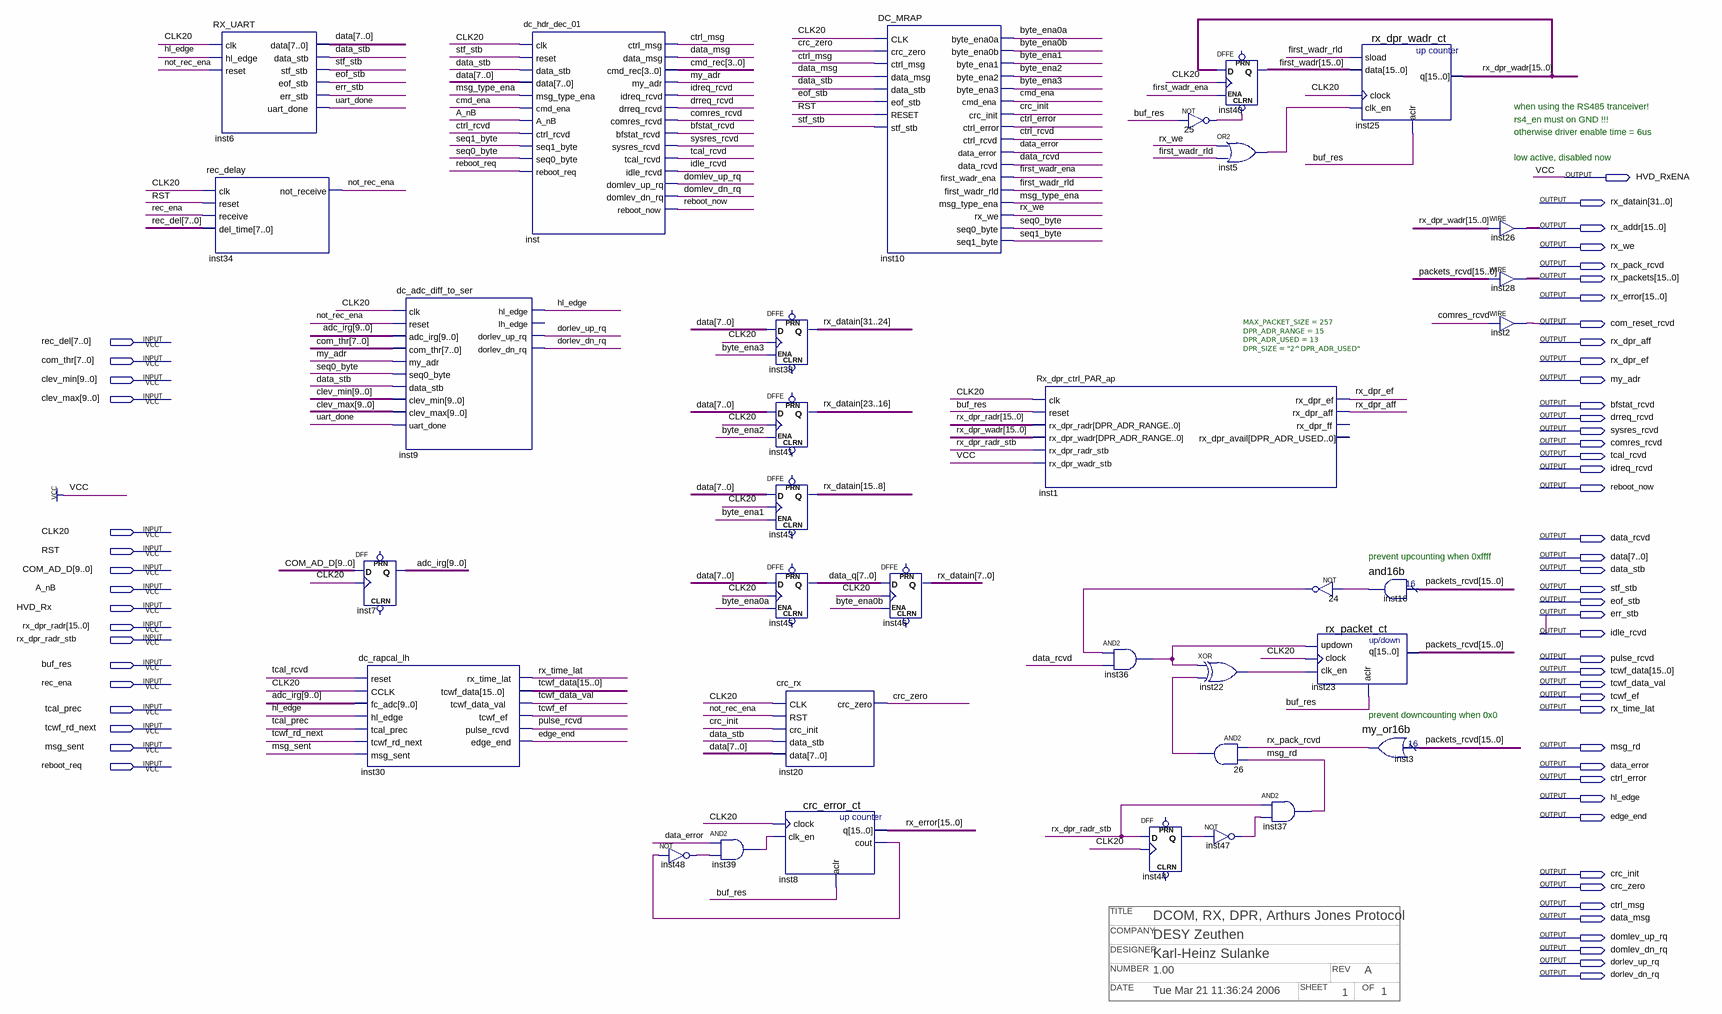
[diagram p0: schematic sheet]
// Quartus schematic DC_Rx_chan_01.bdf as structural Verilog: 34 symbols, 60 pins
// Title block: TITLE: DCOM, RX, DPR, Arthurs Jones Protocol; COMPANY: DESY Zeuthen; DESIGNER: Karl-Heinz Sulanke; NUMBER: 1.00; REV: A; DATE: Tue Mar 21 11:36:24 2006; SHEET: 1; OF: 1
module DC_Rx_chan_01 (
  input  [7:0] rec_del,
  input  [7:0] com_thr,
  input  [9:0] clev_min,
  input  [9:0] clev_max,
  input  CLK20,
  input  RST,
  input  [9:0] COM_AD_D,
  input  A_nB,
  input  HVD_Rx,
  input  [15:0] rx_dpr_radr,
  input  rx_dpr_radr_stb,
  input  buf_res,
  input  rec_ena,
  input  tcal_prec,
  input  tcwf_rd_next,
  input  msg_sent,
  input  reboot_req,
  output HVD_RxENA,
  output [31:0] rx_datain,
  output [15:0] rx_addr,
  output rx_we,
  output rx_pack_rcvd,
  output [15:0] rx_packets,
  output [15:0] rx_error,
  output com_reset_rcvd,
  output rx_dpr_aff,
  output rx_dpr_ef,
  output my_adr,
  output bfstat_rcvd,
  output drreq_rcvd,
  output sysres_rcvd,
  output comres_rcvd,
  output tcal_rcvd,
  output idreq_rcvd,
  output reboot_now,
  output data_rcvd,
  output [7:0] data,
  output data_stb,
  output stf_stb,
  output eof_stb,
  output err_stb,
  output idle_rcvd,
  output pulse_rcvd,
  output [15:0] tcwf_data,
  output tcwf_data_val,
  output tcwf_ef,
  output rx_time_lat,
  output msg_rd,
  output data_error,
  output ctrl_error,
  output hl_edge,
  output edge_end,
  output crc_init,
  output crc_zero,
  output ctrl_msg,
  output data_msg,
  output domlev_up_rq,
  output domlev_dn_rq,
  output dorlev_up_rq,
  output dorlev_dn_rq
);

  wire byte_ena0a, byte_ena0b, byte_ena1, byte_ena2, byte_ena3, cmd_ena, ctrl_rcvd, first_wadr_ena,
       first_wadr_rld, inst5_out, inst8_cout, inst16_result, inst22_out, inst36_out, inst39_out, inst44_q,
       inst47_out, inst48_out, msg_type_ena, n24_out, n25_out, n26_out, not_rec_ena, seq0_byte, seq1_byte,
       uart_done;
  wire [3:0] cmd_rec;
  wire [7:0] data_q;
  wire [9:0] adc_irg;
  wire [15:0] first_wadr, packets_rcvd, rx_dpr_wadr;

  RX_UART inst6 (
    .clk(CLK20), .hl_edge(hl_edge), .reset(not_rec_ena), .data(data), .data_stb(data_stb), .stf_stb(stf_stb),
    .eof_stb(eof_stb), .err_stb(err_stb), .uart_done(uart_done));
  rec_delay inst34 (.clk(CLK20), .reset(RST), .receive(rec_ena), .del_time(rec_del), .not_receive(not_rec_ena));
  DFF inst7[9:0] (.CLK(CLK20), .D(COM_AD_D), .Q(adc_irg));  // open: CLRN, PRN
  dc_rapcal_lh inst30 (
    .reset(tcal_rcvd), .CCLK(CLK20), .fc_adc(adc_irg), .hl_edge(hl_edge), .tcal_prec(tcal_prec),
    .tcwf_rd_next(tcwf_rd_next), .msg_sent(msg_sent), .rx_time_lat(rx_time_lat), .tcwf_data(tcwf_data),
    .tcwf_data_val(tcwf_data_val), .tcwf_ef(tcwf_ef), .pulse_rcvd(pulse_rcvd), .edge_end(edge_end));
  dc_adc_diff_to_ser inst9 (
    .clk(CLK20), .reset(not_rec_ena), .adc_irg(adc_irg), .com_thr(com_thr), .my_adr(my_adr),
    .seq0_byte(seq0_byte), .data_stb(data_stb), .clev_min(clev_min), .clev_max(clev_max),
    .uart_done(uart_done), .hl_edge(hl_edge), .dorlev_up_rq(dorlev_up_rq), .dorlev_dn_rq(dorlev_dn_rq));  // open: lh_edge
  dc_hdr_dec_01 inst (
    .clk(CLK20), .reset(stf_stb), .data_stb(data_stb), .data(data), .msg_type_ena(msg_type_ena),
    .cmd_ena(cmd_ena), .A_nB(A_nB), .ctrl_rcvd(ctrl_rcvd), .seq1_byte(seq1_byte), .seq0_byte(seq0_byte),
    .reboot_req(reboot_req), .ctrl_msg(ctrl_msg), .data_msg(data_msg), .cmd_rec(cmd_rec), .my_adr(my_adr),
    .idreq_rcvd(idreq_rcvd), .drreq_rcvd(drreq_rcvd), .comres_rcvd(comres_rcvd), .bfstat_rcvd(bfstat_rcvd),
    .sysres_rcvd(sysres_rcvd), .tcal_rcvd(tcal_rcvd), .idle_rcvd(err_stb), .domlev_up_rq(domlev_up_rq),
    .domlev_dn_rq(domlev_dn_rq), .reboot_now(reboot_now));
  not inst48 (inst48_out, inst8_cout);
  and inst39 (inst39_out, data_error, inst48_out);
  DFFE inst38[7:0] (.D(data), .CLK(CLK20), .ENA(byte_ena3), .Q(rx_datain[31:24]));  // open: PRN, CLRN
  DFFE inst41[7:0] (.D(data), .CLK(CLK20), .ENA(byte_ena2), .Q(rx_datain[23:16]));  // open: PRN, CLRN
  DFFE inst43[7:0] (.D(data), .CLK(CLK20), .ENA(byte_ena1), .Q(rx_datain[15:8]));  // open: PRN, CLRN
  DFFE inst45[7:0] (.D(data), .CLK(CLK20), .ENA(byte_ena0a), .Q(data_q));  // open: PRN, CLRN
  crc_rx inst20 (
    .CLK(CLK20), .RST(not_rec_ena), .crc_init(crc_init), .data_stb(data_stb), .data(data), .crc_zero(crc_zero));
  crc_error_ct inst8 (.clock(CLK20), .clk_en(inst39_out), .aclr(buf_res), .q(rx_error), .cout(inst8_cout));
  DC_MRAP inst10 (
    .CLK(CLK20), .crc_zero(crc_zero), .ctrl_msg(ctrl_msg), .data_msg(data_msg), .data_stb(data_stb),
    .eof_stb(eof_stb), .RESET(RST), .stf_stb(stf_stb), .byte_ena0a(byte_ena0a), .byte_ena0b(byte_ena0b),
    .byte_ena1(byte_ena1), .byte_ena2(byte_ena2), .byte_ena3(byte_ena3), .cmd_ena(cmd_ena),
    .crc_init(crc_init), .ctrl_error(ctrl_error), .ctrl_rcvd(ctrl_rcvd), .data_error(data_error),
    .data_rcvd(data_rcvd), .first_wadr_ena(first_wadr_ena), .first_wadr_rld(first_wadr_rld),
    .msg_type_ena(msg_type_ena), .rx_we(rx_we), .seq0_byte(seq0_byte), .seq1_byte(seq1_byte));
  DFFE inst46[7:0] (.D(data_q), .CLK(CLK20), .ENA(byte_ena0b), .Q(rx_datain[7:0]));  // open: PRN, CLRN
  Rx_dpr_ctrl_PAR_ap #(.MAX_PACKET_SIZE(257), .DPR_ADR_RANGE(15), .DPR_ADR_USED(13), .DPR_SIZE("2^DPR_ADR_USED")) inst1 (
    .clk(CLK20), .reset(buf_res), .rx_dpr_radr(rx_dpr_radr), .rx_dpr_wadr(rx_dpr_wadr),
    .rx_dpr_radr_stb(rx_dpr_radr_stb), .rx_dpr_wadr_stb(1'b1), .rx_dpr_ef(rx_dpr_ef), .rx_dpr_aff(rx_dpr_aff));  // open: rx_dpr_ff, rx_dpr_avail
  and inst36 (inst36_out, n24_out, data_rcvd);
  DFF inst44 (.CLK(CLK20), .D(rx_dpr_radr_stb), .Q(inst44_q));  // open: CLRN, PRN
  not u_25 (n25_out, buf_res);
  DFFE inst40[15:0] (.CLRN(n25_out), .D(rx_dpr_wadr), .CLK(CLK20), .ENA(first_wadr_ena), .Q(first_wadr));  // open: PRN
  or inst5 (inst5_out, rx_we, first_wadr_rld);
  xor inst22 (inst22_out, inst36_out, n26_out);
  and u_26 (n26_out, rx_pack_rcvd, msg_rd);
  not inst47 (inst47_out, inst44_q);
  and inst37 (msg_rd, rx_dpr_radr_stb, inst47_out);
  not u_24 (n24_out, inst16_result);
  rx_packet_ct inst23 (.updown(inst36_out), .clock(CLK20), .clk_en(inst22_out), .aclr(buf_res), .q(packets_rcvd));
  rx_dpr_wadr_ct inst25 (
    .sload(first_wadr_rld), .data(first_wadr), .clock(CLK20), .clk_en(inst5_out), .aclr(buf_res),
    .q(rx_dpr_wadr));
  and16b inst16 (.data(packets_rcvd), .result(inst16_result));
  my_or16b inst3 (.data(packets_rcvd), .result(rx_pack_rcvd));
  assign rx_addr = rx_dpr_wadr;  // WIRE inst26
  assign rx_packets = packets_rcvd;  // WIRE inst28
  assign com_reset_rcvd = comres_rcvd;  // WIRE inst2

  assign HVD_RxENA = 1'b1;
  assign idle_rcvd = err_stb;

  // Notes on the sheet:
  //   when using the RS485 tranceiver!
  //   rs4_en must on GND !!!
  //   otherwise driver enable time = 6us
  //   low active, disabled now
  //   prevent upcounting when 0xffff
  //   prevent downcounting when 0x0
endmodule
